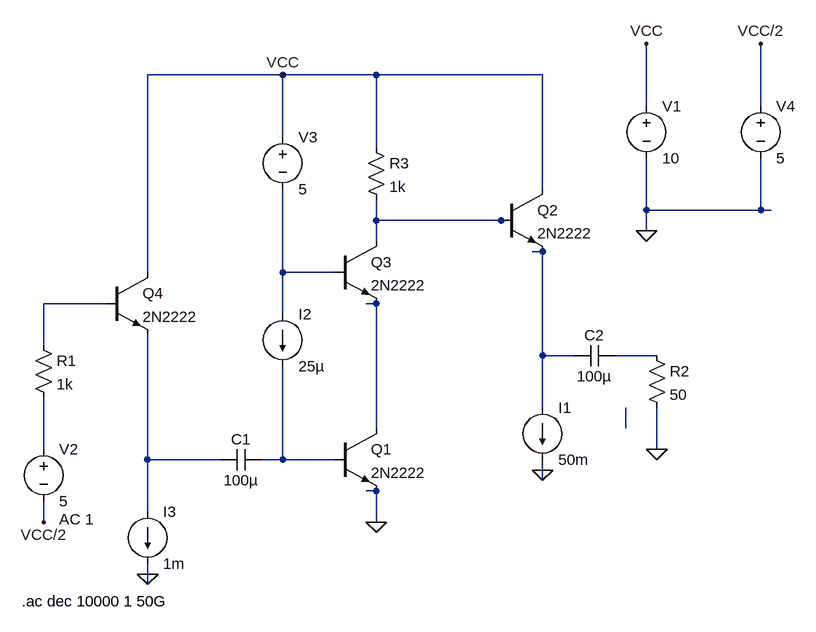
[diagram p0: schematic askis2_1.asc]
askis2_1.asc, the LTspice schematic file:
Version 4
SHEET 1 1672 680
WIRE 400 -432 192 -432
WIRE 544 -432 400 -432
WIRE 800 -432 544 -432
WIRE 960 -384 960 -480
WIRE 1136 -384 1136 -480
WIRE 400 -336 400 -432
WIRE 544 -320 544 -432
WIRE 800 -256 800 -432
WIRE 960 -224 960 -304
WIRE 1136 -224 1136 -304
WIRE 1136 -224 960 -224
WIRE 1152 -224 1136 -224
WIRE 544 -208 544 -240
WIRE 736 -208 544 -208
WIRE 752 -208 736 -208
WIRE 960 -192 960 -224
WIRE 544 -176 544 -208
WIRE 800 -160 784 -160
WIRE 192 -128 192 -432
WIRE 400 -128 400 -256
WIRE 480 -128 400 -128
WIRE 128 -80 32 -80
WIRE 544 -80 528 -80
WIRE 400 -64 400 -128
WIRE 32 -16 32 -80
WIRE 800 0 800 -160
WIRE 848 0 800 0
WIRE 976 0 912 0
WIRE 800 80 800 0
WIRE 544 112 544 -80
WIRE 928 112 928 80
WIRE 32 144 32 64
WIRE 976 144 976 80
WIRE 192 160 192 -32
WIRE 304 160 192 160
WIRE 400 160 400 16
WIRE 400 160 368 160
WIRE 480 160 400 160
WIRE 800 176 800 160
WIRE 800 192 800 176
WIRE 544 208 528 208
WIRE 192 240 192 160
WIRE 32 256 32 224
WIRE 544 256 544 208
WIRE 192 336 192 320
WIRE 192 352 192 336
FLAG 544 256 0
FLAG 32 256 VCC/2
FLAG 400 -432 VCC
FLAG 800 176 0
FLAG 976 144 0
FLAG 960 -480 VCC
FLAG 1136 -480 VCC/2
FLAG 960 -192 0
FLAG 192 336 0
SYMBOL voltage 32 128 R0
WINDOW 123 24 124 Left 2
WINDOW 39 0 0 Left 0
SYMATTR InstName V2
SYMATTR Value 5
SYMATTR Value2 AC 1
SYMBOL res 16 -32 R0
SYMATTR InstName R1
SYMATTR Value 1k
SYMBOL npn 128 -128 R0
SYMATTR InstName Q4
SYMATTR Value 2N2222
SYMBOL current 192 240 R0
WINDOW 123 0 0 Left 0
WINDOW 39 0 0 Left 0
SYMATTR InstName I3
SYMATTR Value 1m
SYMBOL cap 304 144 M90
WINDOW 0 0 32 VBottom 2
WINDOW 3 32 32 VTop 2
SYMATTR InstName C1
SYMATTR Value 100µ
SYMBOL npn 480 112 R0
SYMATTR InstName Q1
SYMATTR Value 2N2222
SYMBOL current 400 -64 R0
WINDOW 123 0 0 Left 0
WINDOW 39 0 0 Left 0
SYMATTR InstName I2
SYMATTR Value 25µ
SYMBOL voltage 400 -352 R0
WINDOW 123 0 0 Left 0
WINDOW 39 0 0 Left 0
SYMATTR InstName V3
SYMATTR Value 5
SYMBOL npn 480 -176 R0
SYMATTR InstName Q3
SYMATTR Value 2N2222
SYMBOL res 528 -336 R0
SYMATTR InstName R3
SYMATTR Value 1k
SYMBOL npn 736 -256 R0
SYMATTR InstName Q2
SYMATTR Value 2N2222
SYMBOL current 800 80 R0
WINDOW 123 0 0 Left 0
WINDOW 39 0 0 Left 0
SYMATTR InstName I1
SYMATTR Value 50m
SYMBOL cap 848 -16 M90
WINDOW 0 0 32 VBottom 2
WINDOW 3 32 32 VTop 2
SYMATTR InstName C2
SYMATTR Value 100µ
SYMBOL res 960 -16 R0
SYMATTR InstName R2
SYMATTR Value 50
SYMBOL voltage 960 -400 R0
WINDOW 123 0 0 Left 0
WINDOW 39 0 0 Left 0
SYMATTR InstName V1
SYMATTR Value 10
SYMBOL voltage 1136 -400 R0
WINDOW 123 0 0 Left 0
WINDOW 39 0 0 Left 0
SYMATTR InstName V4
SYMATTR Value 5
TEXT -2 378 Left 2 !.ac dec 10000 1 50G

The netlist it stands for:
* askis2_1.asc
V2 N008 VCC/2 5 AC 1
R1 N004 N008 1k
Q4 VCC N004 N009 0 2N2222
I3 N009 0 1m
C1 N009 N010 100µ
Q1 N005 N010 0 0 2N2222
I2 N003 N010 25µ
V3 VCC N003 5
Q3 N001 N003 N005 0 2N2222
R3 VCC N001 1k
Q2 VCC N001 N002 0 2N2222
I1 N002 0 50m
C2 N002 N006 100µ
R2 N006 0 50
V1 VCC 0 10
V4 VCC/2 0 5
.model NPN NPN
.model PNP PNP
.lib standard.bjt
.ac dec 10000 1 50G
.backanno
.end